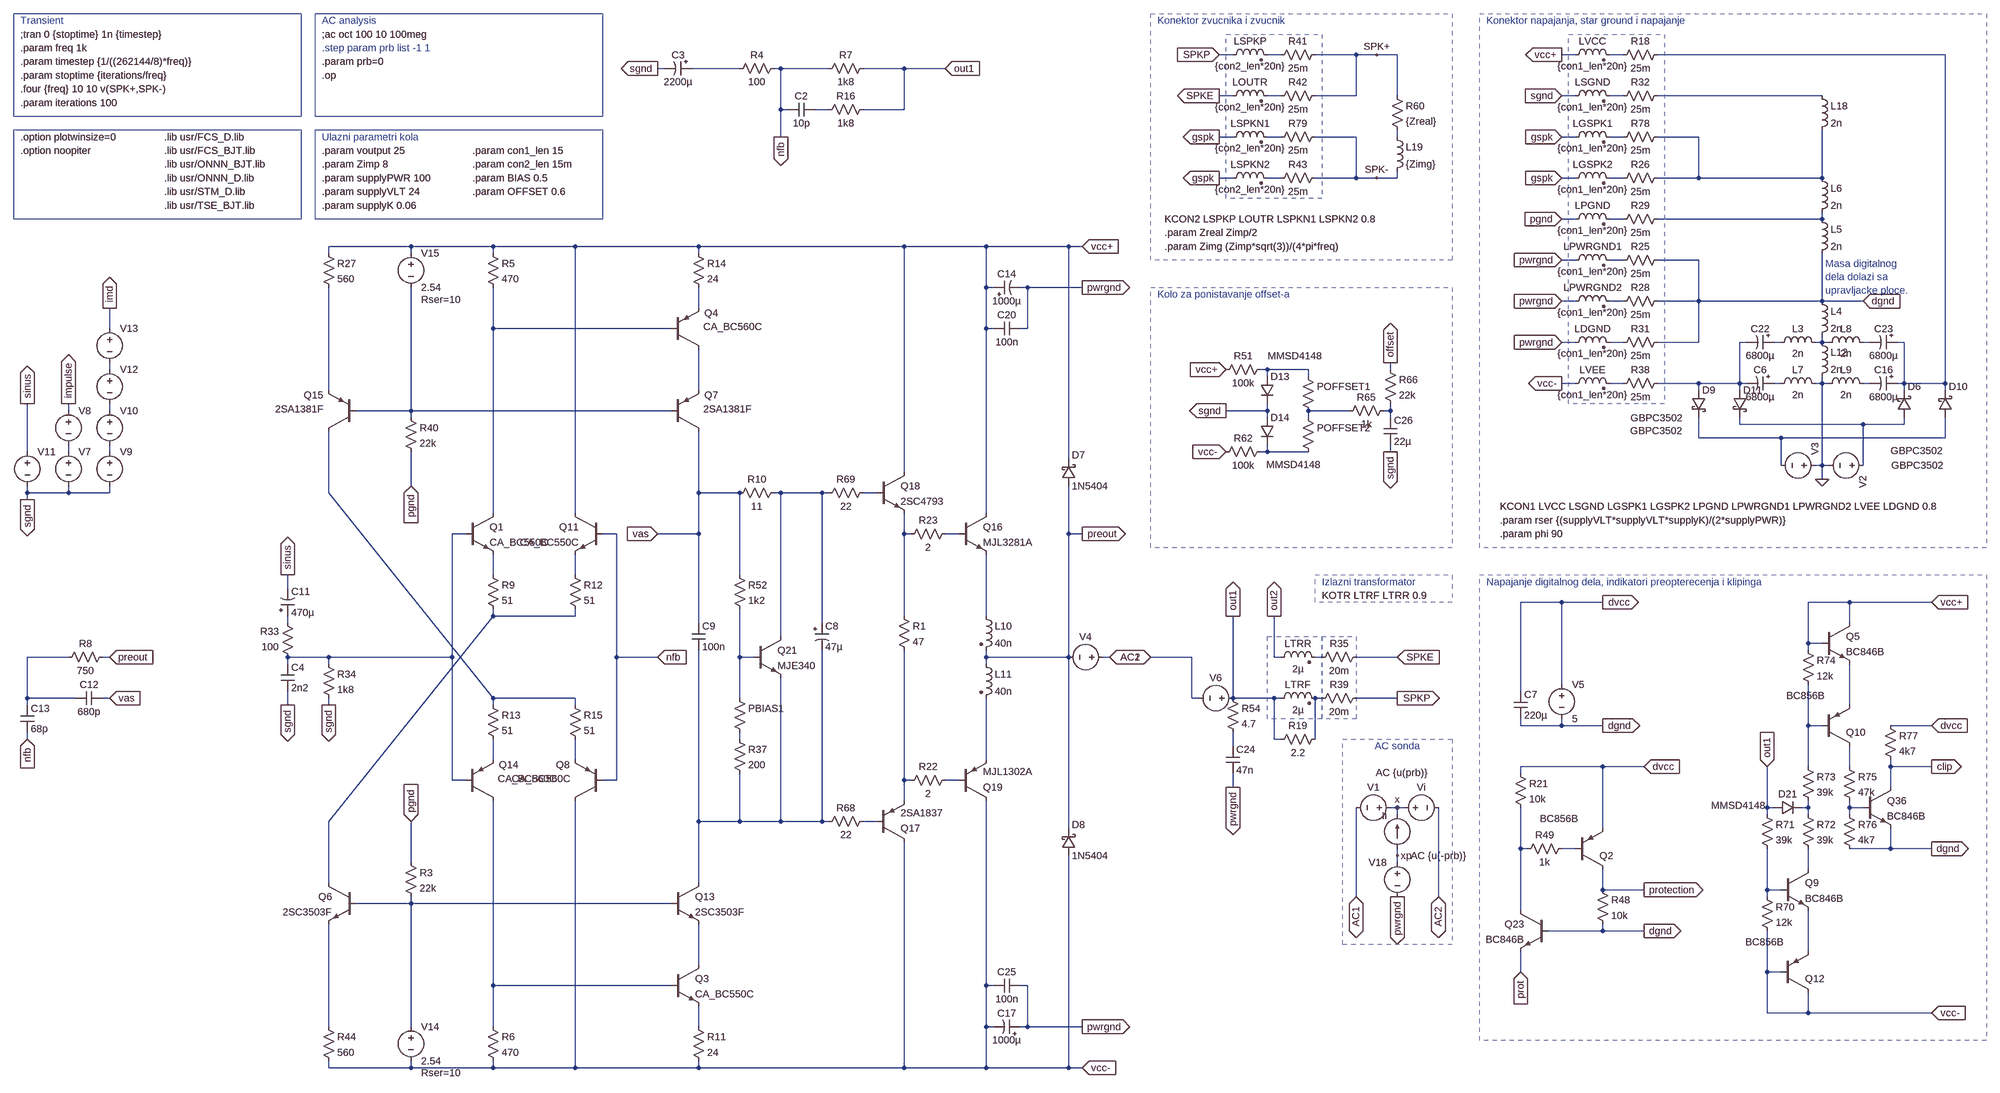
[diagram p0: schematic AMP_Impulse2.asc]
AMP_Impulse2.asc, the LTspice schematic file:
Version 4
SHEET 1 6124 2336
WIRE 2080 -1536 2048 -1536
WIRE 2192 -1536 2160 -1536
WIRE 2368 -1536 2272 -1536
WIRE 2416 -1536 2368 -1536
WIRE 2464 -1536 2416 -1536
WIRE 2880 -1536 2848 -1536
WIRE 2992 -1536 2960 -1536
WIRE 3744 -1536 3072 -1536
WIRE 752 -1504 736 -1504
WIRE 928 -1504 816 -1504
WIRE 1024 -1504 1008 -1504
WIRE 1136 -1504 1024 -1504
WIRE 1312 -1504 1216 -1504
WIRE 1408 -1504 1312 -1504
WIRE 2080 -1440 2048 -1440
WIRE 2192 -1440 2160 -1440
WIRE 2368 -1440 2368 -1536
WIRE 2368 -1440 2272 -1440
WIRE 2464 -1440 2464 -1536
WIRE 2880 -1440 2848 -1440
WIRE 2992 -1440 2960 -1440
WIRE 3456 -1440 3072 -1440
WIRE 1024 -1408 1024 -1504
WIRE 1040 -1408 1024 -1408
WIRE 1136 -1408 1104 -1408
WIRE 1312 -1408 1312 -1504
WIRE 1312 -1408 1216 -1408
WIRE 1024 -1344 1024 -1408
WIRE 2080 -1344 2048 -1344
WIRE 2192 -1344 2160 -1344
WIRE 2368 -1344 2272 -1344
WIRE 2464 -1344 2464 -1360
WIRE 2880 -1344 2848 -1344
WIRE 2992 -1344 2960 -1344
WIRE 3168 -1344 3072 -1344
WIRE 2080 -1248 2048 -1248
WIRE 2192 -1248 2160 -1248
WIRE 2368 -1248 2368 -1344
WIRE 2368 -1248 2272 -1248
WIRE 2416 -1248 2368 -1248
WIRE 2464 -1248 2464 -1264
WIRE 2464 -1248 2416 -1248
WIRE 2880 -1248 2848 -1248
WIRE 2992 -1248 2960 -1248
WIRE 3168 -1248 3168 -1344
WIRE 3168 -1248 3072 -1248
WIRE 3456 -1248 3456 -1360
WIRE 3456 -1248 3168 -1248
WIRE 2880 -1152 2848 -1152
WIRE 2992 -1152 2960 -1152
WIRE 3456 -1152 3456 -1168
WIRE 3456 -1152 3072 -1152
WIRE 160 -1088 -32 -1088
WIRE 352 -1088 160 -1088
WIRE 544 -1088 352 -1088
WIRE 832 -1088 544 -1088
WIRE 1312 -1088 832 -1088
WIRE 1408 -1088 1312 -1088
WIRE 1504 -1088 1408 -1088
WIRE 1696 -1088 1504 -1088
WIRE 1728 -1088 1696 -1088
WIRE -32 -1072 -32 -1088
WIRE 160 -1072 160 -1088
WIRE 352 -1072 352 -1088
WIRE 832 -1072 832 -1088
WIRE 2880 -1056 2848 -1056
WIRE 2992 -1056 2960 -1056
WIRE 3168 -1056 3072 -1056
WIRE 1504 -992 1504 -1088
WIRE 1520 -992 1504 -992
WIRE 1600 -992 1584 -992
WIRE 1728 -992 1600 -992
WIRE 2880 -960 2848 -960
WIRE 2992 -960 2960 -960
WIRE 3168 -960 3168 -1056
WIRE 3168 -960 3072 -960
WIRE 3456 -960 3456 -1072
WIRE 3456 -960 3168 -960
WIRE 3552 -960 3456 -960
WIRE 832 -944 832 -992
WIRE -544 -896 -544 -944
WIRE 352 -896 352 -992
WIRE 768 -896 352 -896
WIRE 1504 -896 1504 -992
WIRE 1520 -896 1504 -896
WIRE 1600 -896 1600 -992
WIRE 1600 -896 1584 -896
WIRE 2880 -864 2848 -864
WIRE 2992 -864 2960 -864
WIRE 3168 -864 3168 -960
WIRE 3168 -864 3072 -864
WIRE 3280 -864 3264 -864
WIRE 3360 -864 3344 -864
WIRE 3456 -864 3456 -880
WIRE 3456 -864 3440 -864
WIRE 3472 -864 3456 -864
WIRE 3568 -864 3552 -864
WIRE 3648 -864 3632 -864
WIRE -544 -800 -544 -816
WIRE 2160 -800 2144 -800
WIRE 2256 -800 2160 -800
WIRE 2448 -800 2448 -816
WIRE 2160 -784 2160 -800
WIRE 2256 -784 2256 -800
WIRE 2880 -768 2848 -768
WIRE 2992 -768 2960 -768
WIRE 3168 -768 3072 -768
WIRE 3264 -768 3264 -864
WIRE 3264 -768 3168 -768
WIRE 3280 -768 3264 -768
WIRE 3360 -768 3344 -768
WIRE 3456 -768 3456 -784
WIRE 3456 -768 3440 -768
WIRE 3472 -768 3456 -768
WIRE 3568 -768 3552 -768
WIRE 3648 -768 3648 -864
WIRE 3648 -768 3632 -768
WIRE 3744 -768 3744 -1536
WIRE 3744 -768 3648 -768
WIRE -32 -752 -32 -992
WIRE 832 -752 832 -848
WIRE 3168 -752 3168 -768
WIRE 3264 -752 3264 -768
WIRE 3648 -752 3648 -768
WIRE 3744 -752 3744 -768
WIRE -640 -704 -640 -720
WIRE -544 -704 -544 -720
WIRE 160 -704 160 -992
WIRE 160 -704 32 -704
WIRE 768 -704 160 -704
WIRE 1312 -704 1312 -1088
WIRE 1504 -704 1504 -896
WIRE 2160 -704 2160 -720
WIRE 2160 -704 2064 -704
WIRE 2352 -704 2256 -704
WIRE 2448 -704 2448 -720
WIRE 2448 -704 2432 -704
WIRE 160 -688 160 -704
WIRE 2160 -688 2160 -704
WIRE 2256 -688 2256 -704
WIRE 2448 -688 2448 -704
WIRE 3264 -672 3264 -688
WIRE 3552 -672 3264 -672
WIRE 3648 -672 3648 -688
WIRE 3648 -672 3552 -672
WIRE 3168 -640 3168 -688
WIRE 3360 -640 3168 -640
WIRE 3744 -640 3744 -688
WIRE 3744 -640 3360 -640
WIRE -736 -608 -736 -720
WIRE -640 -608 -640 -624
WIRE -544 -608 -544 -624
WIRE 2160 -608 2160 -624
WIRE 2160 -608 2144 -608
WIRE 2256 -608 2160 -608
WIRE 2448 -608 2448 -624
WIRE 1696 -592 1696 -1088
WIRE 3360 -576 3360 -640
WIRE 3456 -576 3456 -768
WIRE 3456 -576 3440 -576
WIRE 3472 -576 3456 -576
WIRE 3552 -576 3552 -672
WIRE 1312 -560 1312 -704
WIRE 3456 -544 3456 -576
WIRE 160 -528 160 -608
WIRE -736 -512 -736 -528
WIRE -640 -512 -640 -528
WIRE -640 -512 -736 -512
WIRE -544 -512 -544 -528
WIRE -544 -512 -640 -512
WIRE -32 -512 -32 -656
WIRE 832 -512 832 -656
WIRE 928 -512 832 -512
WIRE 1024 -512 1008 -512
WIRE 1120 -512 1024 -512
WIRE 1136 -512 1120 -512
WIRE 1248 -512 1216 -512
WIRE -736 -496 -736 -512
WIRE 352 -464 352 -896
WIRE 544 -464 544 -1088
WIRE 1504 -464 1504 -704
WIRE 288 -416 256 -416
WIRE 640 -416 608 -416
WIRE 832 -416 832 -512
WIRE 832 -416 736 -416
WIRE 1312 -416 1312 -464
WIRE 1328 -416 1312 -416
WIRE 1440 -416 1408 -416
WIRE 1696 -416 1696 -528
WIRE 1728 -416 1696 -416
WIRE 352 -320 352 -368
WIRE 544 -320 544 -368
WIRE 928 -320 928 -512
WIRE -128 -288 -128 -320
WIRE 2800 -256 2752 -256
WIRE 2848 -256 2800 -256
WIRE 2944 -256 2848 -256
WIRE 3520 -256 3424 -256
WIRE 3712 -256 3520 -256
WIRE 352 -224 352 -240
WIRE 544 -224 544 -240
WIRE 544 -224 352 -224
WIRE 1312 -224 1312 -416
WIRE 1504 -224 1504 -368
WIRE -128 -208 -128 -224
WIRE 832 -208 832 -416
WIRE 1120 -208 1120 -512
WIRE 3520 -208 3520 -256
WIRE 1024 -176 1024 -512
WIRE 3424 -160 3424 -256
WIRE 3456 -160 3424 -160
WIRE 3424 -144 3424 -160
WIRE -640 -128 -736 -128
WIRE -544 -128 -560 -128
WIRE -32 -128 -128 -128
WIRE 256 -128 256 -416
WIRE 256 -128 -32 -128
WIRE 640 -128 640 -416
WIRE 736 -128 640 -128
WIRE 928 -128 928 -240
WIRE 960 -128 928 -128
WIRE 1504 -128 1504 -144
WIRE 1600 -128 1504 -128
WIRE 1696 -128 1696 -416
WIRE 1696 -128 1600 -128
WIRE 1792 -128 1776 -128
WIRE 1984 -128 1888 -128
WIRE 2176 -128 2176 -224
WIRE 2192 -128 2176 -128
WIRE 2288 -128 2272 -128
WIRE 2464 -128 2368 -128
WIRE -128 -112 -128 -128
WIRE -32 -112 -32 -128
WIRE 1504 -112 1504 -128
WIRE 2848 -64 2848 -256
WIRE 2752 -48 2752 -256
WIRE -736 -32 -736 -128
WIRE -624 -32 -736 -32
WIRE -544 -32 -560 -32
WIRE 352 -32 -32 -512
WIRE 544 -32 352 -32
WIRE 928 -32 928 -128
WIRE 1984 -32 1984 -128
WIRE 2000 -32 1984 -32
WIRE 2080 -32 2080 -224
WIRE 2176 -32 2080 -32
WIRE 2192 -32 2176 -32
WIRE 2288 -32 2272 -32
WIRE 2464 -32 2368 -32
WIRE -736 -16 -736 -32
WIRE -128 -16 -128 -48
WIRE -32 -16 -32 -32
WIRE 352 -16 352 -32
WIRE 544 -16 544 -32
WIRE 3520 -16 3520 -112
WIRE 2752 32 2752 16
WIRE 2848 32 2848 16
WIRE 2848 32 2752 32
WIRE 2944 32 2848 32
WIRE 3424 32 3424 -64
WIRE 3456 32 3424 32
WIRE 3712 32 3616 32
WIRE -736 64 -736 48
WIRE 928 64 928 48
WIRE 2176 64 2176 -32
WIRE 2192 64 2176 64
WIRE 2272 64 2272 -32
WIRE 2080 80 2080 48
WIRE 352 112 352 64
WIRE 544 112 544 64
WIRE 1504 112 1504 -32
WIRE 2944 128 2752 128
WIRE 3040 128 2944 128
WIRE 3424 128 3424 32
WIRE 3520 128 3520 80
WIRE 3616 128 3616 112
WIRE 3712 128 3616 128
WIRE 2752 144 2752 128
WIRE 256 160 256 -128
WIRE 288 160 256 160
WIRE 640 160 640 -128
WIRE 640 160 608 160
WIRE 1312 160 1312 -144
WIRE 1328 160 1312 160
WIRE 1440 160 1408 160
WIRE 2080 176 2080 144
WIRE 3616 176 3616 128
WIRE 1312 208 1312 160
WIRE 2464 224 2448 224
WIRE 2480 224 2464 224
WIRE 3328 224 3328 128
WIRE 3344 224 3328 224
WIRE 3424 224 3424 208
WIRE 3424 224 3408 224
WIRE 3520 224 3520 208
WIRE 3552 224 3520 224
WIRE 2464 240 2464 224
WIRE 3328 240 3328 224
WIRE 3424 240 3424 224
WIRE 3520 240 3520 224
WIRE -32 256 352 -224
WIRE 832 256 832 -144
WIRE 928 256 928 144
WIRE 928 256 832 256
WIRE 1024 256 1024 -80
WIRE 1024 256 928 256
WIRE 1120 256 1120 -144
WIRE 1120 256 1024 256
WIRE 1136 256 1120 256
WIRE 1248 256 1216 256
WIRE 1696 272 1696 -128
WIRE 2944 272 2944 128
WIRE 2752 320 2752 224
WIRE 2768 320 2752 320
WIRE 2880 320 2848 320
WIRE 3616 320 3616 272
WIRE 3616 320 3520 320
WIRE 3712 320 3616 320
WIRE 2464 336 2464 320
WIRE 160 352 160 256
WIRE 2464 352 2464 336
WIRE 3424 368 3424 320
WIRE -32 400 -32 256
WIRE 832 400 832 256
WIRE 2944 416 2944 368
WIRE 3040 416 2944 416
WIRE 3328 416 3328 320
WIRE 3360 416 3328 416
WIRE 2368 432 2368 224
WIRE 2560 432 2560 224
WIRE 3328 432 3328 416
WIRE 160 448 160 432
WIRE 160 448 32 448
WIRE 768 448 160 448
WIRE 2752 464 2752 320
WIRE 2944 512 2944 496
WIRE 2944 512 2816 512
WIRE 3040 512 2944 512
WIRE 3424 560 3424 464
WIRE 832 592 832 496
WIRE 2752 608 2752 560
WIRE 3328 608 3328 512
WIRE 3360 608 3328 608
WIRE 352 640 352 208
WIRE 768 640 352 640
WIRE 1504 640 1504 208
WIRE 1520 640 1504 640
WIRE 1600 640 1584 640
WIRE 3328 704 3328 608
WIRE 3424 704 3424 656
WIRE 3424 704 3328 704
WIRE 3712 704 3424 704
WIRE -32 736 -32 496
WIRE 160 736 160 448
WIRE 352 736 352 640
WIRE 832 736 832 688
WIRE 1504 736 1504 640
WIRE 1520 736 1504 736
WIRE 1600 736 1600 640
WIRE 1600 736 1584 736
WIRE 1728 736 1600 736
WIRE -32 832 -32 816
WIRE 160 832 160 816
WIRE 160 832 -32 832
WIRE 352 832 352 816
WIRE 352 832 160 832
WIRE 544 832 544 208
WIRE 544 832 352 832
WIRE 832 832 832 816
WIRE 832 832 544 832
WIRE 1312 832 1312 304
WIRE 1312 832 832 832
WIRE 1408 832 1312 832
WIRE 1504 832 1504 736
WIRE 1504 832 1408 832
WIRE 1696 832 1696 336
WIRE 1696 832 1504 832
WIRE 1728 832 1696 832
FLAG 1728 -1088 vcc+
IOPIN 1728 -1088 In
FLAG 2464 224 x
FLAG 1728 832 vcc-
IOPIN 1728 832 In
FLAG 1408 -1504 out1
IOPIN 1408 -1504 In
FLAG 2464 336 xp
FLAG 2080 176 pwrgnd
IOPIN 2080 176 Out
FLAG -128 -16 sgnd
IOPIN -128 -16 Out
FLAG -32 -16 sgnd
IOPIN -32 -16 Out
FLAG 1728 -992 pwrgnd
IOPIN 1728 -992 Out
FLAG 2752 608 prot
IOPIN 2752 608 In
FLAG 3040 512 dgnd
IOPIN 3040 512 Out
FLAG 3040 128 dvcc
IOPIN 3040 128 In
FLAG 3040 416 protection
IOPIN 3040 416 Out
FLAG 2176 -224 out2
IOPIN 2176 -224 Out
FLAG 3712 128 clip
IOPIN 3712 128 Out
FLAG 3712 320 dgnd
IOPIN 3712 320 Out
FLAG 3712 32 dvcc
IOPIN 3712 32 In
FLAG -736 -496 sgnd
IOPIN -736 -496 Out
FLAG -736 -720 sinus
IOPIN -736 -720 Out
FLAG 1728 736 pwrgnd
IOPIN 1728 736 Out
FLAG 2848 -1536 vcc+
IOPIN 2848 -1536 Out
FLAG 2848 -768 vcc-
IOPIN 2848 -768 Out
FLAG 2848 -1248 gspk
IOPIN 2848 -1248 In
FLAG 2848 -960 pwrgnd
IOPIN 2848 -960 In
FLAG 2848 -1152 pgnd
IOPIN 2848 -1152 In
FLAG 2848 -1440 sgnd
IOPIN 2848 -1440 In
FLAG 2464 -32 SPKP
IOPIN 2464 -32 Out
FLAG 2048 -1248 gspk
IOPIN 2048 -1248 Out
FLAG 2048 -1536 SPKP
IOPIN 2048 -1536 In
FLAG 2048 -1440 SPKE
IOPIN 2048 -1440 Out
FLAG 3328 128 out1
IOPIN 3328 128 In
FLAG 3552 -960 dgnd
IOPIN 3552 -960 In
FLAG 3712 704 vcc-
IOPIN 3712 704 In
FLAG 3712 -256 vcc+
IOPIN 3712 -256 In
FLAG 2944 -256 dvcc
IOPIN 2944 -256 Out
FLAG 2944 32 dgnd
IOPIN 2944 32 Out
FLAG 2848 -1056 pwrgnd
IOPIN 2848 -1056 In
FLAG 2848 -864 pwrgnd
IOPIN 2848 -864 In
FLAG 3456 -544 0
FLAG 2064 -800 vcc+
IOPIN 2064 -800 In
FLAG 2064 -608 vcc-
IOPIN 2064 -608 In
FLAG 2064 -704 sgnd
IOPIN 2064 -704 Out
FLAG 2448 -608 sgnd
IOPIN 2448 -608 Out
FLAG 2448 -816 offset
IOPIN 2448 -816 Out
FLAG 2368 432 AC1
IOPIN 2368 432 BiDir
FLAG 2560 432 AC2
IOPIN 2560 432 BiDir
FLAG 1792 -128 AC1
IOPIN 1792 -128 BiDir
FLAG 1888 -128 AC2
IOPIN 1888 -128 BiDir
FLAG 2464 432 pwrgnd
IOPIN 2464 432 Out
FLAG 2416 -1536 SPK+
FLAG 2416 -1248 SPK-
FLAG 2464 -128 SPKE
IOPIN 2464 -128 In
FLAG 2848 -1344 gspk
IOPIN 2848 -1344 In
FLAG 2048 -1344 gspk
IOPIN 2048 -1344 Out
FLAG 1728 -416 preout
IOPIN 1728 -416 Out
FLAG 160 256 pgnd
IOPIN 160 256 In
FLAG -544 -944 imd
IOPIN -544 -944 Out
FLAG 736 -1504 sgnd
IOPIN 736 -1504 Out
FLAG 2080 -224 out1
IOPIN 2080 -224 Out
FLAG -544 -128 preout
IOPIN -544 -128 In
FLAG -640 -720 impulse
IOPIN -640 -720 Out
FLAG 1024 -1344 nfb
IOPIN 1024 -1344 Out
FLAG 736 -128 nfb
IOPIN 736 -128 In
FLAG -128 -320 sinus
IOPIN -128 -320 Out
FLAG 736 -416 vas
IOPIN 736 -416 In
FLAG -544 -32 vas
IOPIN -544 -32 In
FLAG -736 64 nfb
IOPIN -736 64 In
FLAG 160 -528 pgnd
IOPIN 160 -528 In
DATAFLAG 2800 -256 ""
DATAFLAG 1600 -128 ""
DATAFLAG 1504 -704 "ic(q16)"
DATAFLAG 1408 -1088 ""
DATAFLAG 1408 832 ""
DATAFLAG 1312 -704 "Ic(Q18)"
SYMBOL voltage 3568 -576 R90
WINDOW 123 0 0 Left 2
WINDOW 3 -94 177 Invisible 2
SYMATTR Value SINE(0 {supplyVLT*sqrt(2)} 50 0 0 {phi})
SYMATTR SpiceLine Rser={rser}
SYMATTR InstName V2
SYMBOL current 2464 320 R180
WINDOW 0 24 77 Left 2
WINDOW 3 24 0 Invisible 2
WINDOW 123 -71 178 Left 2
WINDOW 39 0 0 Left 2
SYMATTR InstName Ii
SYMATTR Value 0
SYMATTR Value2 AC {u(prb)}
SYMBOL voltage 2464 224 R270
WINDOW 0 32 56 VTop 2
WINDOW 3 -32 56 Invisible 2
WINDOW 123 -97 96 VBottom 2
WINDOW 39 -32 56 VBottom 2
SYMATTR InstName Vi
SYMATTR Value 0
SYMATTR Value2 AC {u(-prb)}
SYMBOL res -112 -112 R180
WINDOW 0 36 76 Left 2
WINDOW 3 36 40 Left 2
SYMATTR InstName R33
SYMATTR Value 100
SYMBOL res -48 -128 R0
SYMATTR InstName R34
SYMATTR Value 1k8
SYMBOL schottky 1680 -528 M180
WINDOW 0 24 72 Left 2
WINDOW 3 24 0 Left 2
SYMATTR InstName D7
SYMATTR Value 1N5404
SYMATTR Description Diode
SYMATTR Type diode
SYMBOL schottky 1680 336 M180
WINDOW 0 24 72 Left 2
WINDOW 3 24 0 Left 2
SYMATTR InstName D8
SYMATTR Value 1N5404
SYMATTR Description Diode
SYMATTR Type diode
SYMBOL ind2 2176 -16 R270
WINDOW 0 32 56 VTop 2
WINDOW 3 4 56 VBottom 2
SYMATTR InstName LTRF
SYMATTR Value 2µ
SYMATTR SpiceLine Rser=10m Rpar=3meg Cpar=1p
SYMATTR Type ind
SYMBOL res 2176 80 R270
WINDOW 0 32 56 VTop 2
WINDOW 3 0 56 VBottom 2
SYMATTR InstName R19
SYMATTR Value 2.2
SYMBOL voltage 2464 224 R90
WINDOW 0 -32 56 VBottom 2
WINDOW 3 32 56 Invisible 2
WINDOW 123 0 0 Left 2
WINDOW 39 0 0 Left 2
SYMATTR InstName V1
SYMATTR Value 0
SYMBOL schottky 3632 -688 M180
WINDOW 0 24 72 Left 2
WINDOW 3 -14 -112 Left 2
SYMATTR InstName D6
SYMATTR Value GBPC3502
SYMATTR Description Diode
SYMATTR Type diode
SYMBOL schottky 3152 -752 R0
WINDOW 3 -144 95 Left 2
SYMATTR Value GBPC3502
SYMATTR InstName D9
SYMATTR Description Diode
SYMATTR Type diode
SYMBOL voltage 3456 -576 M270
WINDOW 123 0 0 Left 2
WINDOW 3 -96 -62 Invisible 2
SYMATTR Value SINE(0 {supplyVLT*sqrt(2)} 50 0 0 {phi})
SYMATTR SpiceLine Rser={rser}
SYMATTR InstName V3
SYMBOL res 2064 -48 R0
SYMATTR InstName R54
SYMATTR Value 4.7
SYMBOL res 2448 -1456 R0
SYMATTR InstName R60
SYMATTR Value {Zreal}
SYMBOL ind 2448 -1360 R0
SYMATTR InstName L19
SYMATTR Value {Zimg}
SYMATTR SpiceLine Cpar=10p
SYMBOL voltage 2464 336 M0
WINDOW 123 0 0 Left 2
WINDOW 39 0 0 Left 2
WINDOW 3 24 96 Invisible 2
SYMATTR Value 0
SYMATTR InstName V18
SYMBOL npn 1440 -464 R0
SYMATTR InstName Q16
SYMATTR Value MJL3281A
SYMBOL pnp 1248 304 M180
SYMATTR InstName Q17
SYMATTR Value 2SA1837
SYMBOL npn 1248 -560 R0
SYMATTR InstName Q18
SYMATTR Value 2SC4793
SYMBOL pnp 1440 208 M180
SYMATTR InstName Q19
SYMATTR Value MJL1302A
SYMBOL res 1424 144 R90
WINDOW 0 0 56 VBottom 2
WINDOW 3 32 56 VTop 2
SYMATTR InstName R22
SYMATTR Value 2
SYMBOL res 1424 -432 R90
WINDOW 0 0 56 VBottom 2
WINDOW 3 32 56 VTop 2
SYMATTR InstName R23
SYMATTR Value 2
SYMBOL cap 1520 -912 M90
WINDOW 0 0 32 VBottom 2
WINDOW 3 32 32 VTop 2
SYMATTR InstName C20
SYMATTR Value 100n
SYMATTR SpiceLine Rser=700m Lser=7n Rpar=4.4meg Cpar=1p
SYMBOL ind2 1488 -240 R0
SYMATTR InstName L10
SYMATTR Value 40n
SYMATTR SpiceLine Rser=220m Cpar=3p
SYMATTR Type ind
SYMBOL ind2 1488 -128 R0
SYMATTR InstName L11
SYMATTR Value 40n
SYMATTR SpiceLine Rser=220m Cpar=3p
SYMATTR Type ind
SYMBOL cap 2064 80 R0
SYMATTR InstName C24
SYMATTR Value 47n
SYMATTR SpiceLine Rser=700m Lser=7n Rpar=4.4meg Cpar=1p
SYMBOL cap 1584 624 R90
WINDOW 0 0 32 VBottom 2
WINDOW 3 32 32 VTop 2
SYMATTR InstName C25
SYMATTR Value 100n
SYMATTR SpiceLine Rser=700m Lser=7n Rpar=4.4meg Cpar=1p
SYMBOL polcap 3344 -784 R90
WINDOW 0 0 32 VBottom 2
WINDOW 3 32 32 VTop 2
SYMATTR InstName C6
SYMATTR Value 6800µ
SYMATTR SpiceLine V=50 Irms=2.5 Rser=0.08 Lser=20n Rpar=40k Cpar=3p mfg="Nichicon" pn="UVZ1H682MRD" type="Al electrolytic"
SYMATTR Description Capacitor
SYMATTR Type cap
SYMBOL res 2736 128 R0
SYMATTR InstName R21
SYMATTR Value 10k
SYMBOL npn 2816 464 M0
SYMATTR InstName Q23
SYMATTR Value BC846B
SYMBOL pnp 2880 368 M180
WINDOW 3 -83 118 Left 2
SYMATTR Value BC856B
SYMATTR InstName Q2
SYMBOL res 2928 400 R0
SYMATTR InstName R48
SYMATTR Value 10k
SYMBOL res 2864 304 R90
WINDOW 0 0 56 VBottom 2
WINDOW 3 32 56 VTop 2
SYMATTR InstName R49
SYMATTR Value 1k
SYMBOL res 912 -48 R0
WINDOW 3 36 76 Invisible 2
SYMATTR Value {1+(500*BIAS)}
SYMATTR InstName PBIAS1
SYMBOL res 912 -336 R0
SYMATTR InstName R52
SYMATTR Value 1k2
SYMBOL schottky 3728 -688 M180
WINDOW 0 24 72 Left 2
WINDOW 3 -112 -78 Left 2
SYMATTR InstName D10
SYMATTR Value GBPC3502
SYMATTR Description Diode
SYMATTR Type diode
SYMBOL schottky 3248 -752 R0
WINDOW 3 -239 65 Left 2
SYMATTR Value GBPC3502
SYMATTR InstName D11
SYMATTR Description Diode
SYMATTR Type diode
SYMBOL ind2 2864 -1520 R270
WINDOW 0 32 56 VTop 2
WINDOW 3 5 56 VBottom 2
SYMATTR InstName LVCC
SYMATTR Value {con1_len*20n}
SYMATTR SpiceLine Rser={con1_len*.5m}
SYMATTR Type ind
SYMBOL ind2 2864 -752 R270
WINDOW 0 32 56 VTop 2
WINDOW 3 5 56 VBottom 2
SYMATTR InstName LVEE
SYMATTR Value {con1_len*20n}
SYMATTR SpiceLine Rser={con1_len*.5m}
SYMATTR Type ind
SYMBOL ind2 2176 -112 R270
WINDOW 0 32 56 VTop 2
WINDOW 3 4 56 VBottom 2
SYMATTR InstName LTRR
SYMATTR Value 2µ
SYMATTR SpiceLine Rser=80m Rpar=3meg Cpar=1p
SYMATTR Type ind
SYMBOL res 3312 416 R0
SYMATTR InstName R70
SYMATTR Value 12k
SYMBOL res 3312 224 R0
SYMATTR InstName R71
SYMATTR Value 39k
SYMBOL res 3408 224 R0
SYMATTR InstName R72
SYMATTR Value 39k
SYMBOL diode 3344 240 R270
WINDOW 0 32 32 VTop 2
WINDOW 3 37 -83 VBottom 2
SYMATTR InstName D21
SYMATTR Value MMSD4148
SYMBOL res 3408 112 R0
SYMATTR InstName R73
SYMATTR Value 39k
SYMBOL res 3408 -160 R0
SYMATTR InstName R74
SYMATTR Value 12k
SYMBOL res 3504 112 R0
SYMATTR InstName R75
SYMATTR Value 47k
SYMBOL npn 3552 176 R0
SYMATTR InstName Q36
SYMATTR Value BC846B
SYMBOL res 3504 224 R0
SYMATTR InstName R76
SYMATTR Value 4k7
SYMBOL res 3600 16 R0
SYMATTR InstName R77
SYMATTR Value 4k7
SYMBOL cap -144 -48 M180
WINDOW 0 24 56 Left 2
WINDOW 3 24 8 Left 2
SYMATTR InstName C4
SYMATTR Value 2n2
SYMBOL voltage -736 -624 R0
WINDOW 123 24 44 Left 2
WINDOW 39 0 0 Left 2
WINDOW 3 24 96 Invisible 2
SYMATTR Value SINE(0 {voutput/18} {freq})
SYMATTR InstName V11
SYMBOL res 1296 -240 R0
SYMATTR InstName R1
SYMATTR Value 47
SYMBOL npn 960 -176 R0
SYMATTR InstName Q21
SYMATTR Value MJE340
SYMBOL ind2 2864 -1232 R270
WINDOW 0 32 56 VTop 2
WINDOW 3 5 56 VBottom 2
SYMATTR InstName LGSPK2
SYMATTR Value {con1_len*20n}
SYMATTR SpiceLine Rser={con1_len*.5m}
SYMATTR Type ind
SYMBOL ind2 2864 -944 R270
WINDOW 0 32 56 VTop 2
WINDOW 3 5 56 VBottom 2
SYMATTR InstName LPWRGND2
SYMATTR Value {con1_len*20n}
SYMATTR SpiceLine Rser={con1_len*.5m}
SYMATTR Type ind
SYMBOL ind2 2864 -1136 R270
WINDOW 0 32 56 VTop 2
WINDOW 3 5 56 VBottom 2
SYMATTR InstName LPGND
SYMATTR Value {con1_len*20n}
SYMATTR SpiceLine Rser={con1_len*.5m}
SYMATTR Type ind
SYMBOL ind2 2864 -1424 R270
WINDOW 0 32 56 VTop 2
WINDOW 3 5 56 VBottom 2
SYMATTR InstName LSGND
SYMATTR Value {con1_len*20n}
SYMATTR SpiceLine Rser={con1_len*.5m}
SYMATTR Type ind
SYMBOL res 3088 -1552 R90
WINDOW 0 0 56 VBottom 2
WINDOW 3 32 56 VTop 2
SYMATTR InstName R18
SYMATTR Value 25m
SYMBOL res 3088 -1264 R90
WINDOW 0 0 56 VBottom 2
WINDOW 3 32 56 VTop 2
SYMATTR InstName R26
SYMATTR Value 25m
SYMBOL res 3088 -976 R90
WINDOW 0 0 56 VBottom 2
WINDOW 3 32 56 VTop 2
SYMATTR InstName R28
SYMATTR Value 25m
SYMBOL res 3088 -1168 R90
WINDOW 0 0 56 VBottom 2
WINDOW 3 32 56 VTop 2
SYMATTR InstName R29
SYMATTR Value 25m
SYMBOL res 3088 -1456 R90
WINDOW 0 0 56 VBottom 2
WINDOW 3 32 56 VTop 2
SYMATTR InstName R32
SYMATTR Value 25m
SYMBOL res 3088 -784 R90
WINDOW 0 0 56 VBottom 2
WINDOW 3 32 56 VTop 2
SYMATTR InstName R38
SYMATTR Value 25m
SYMBOL ind 3440 -976 R0
SYMATTR InstName L4
SYMATTR Value 2n
SYMATTR SpiceLine Rser=1m
SYMBOL ind 3440 -1168 R0
SYMATTR InstName L5
SYMATTR Value 2n
SYMATTR SpiceLine Rser=1m
SYMBOL ind 3440 -1264 R0
SYMATTR InstName L6
SYMATTR Value 2n
SYMATTR SpiceLine Rser=1m
SYMBOL ind 3440 -1456 R0
SYMATTR InstName L18
SYMATTR Value 2n
SYMATTR SpiceLine Rser=1m
SYMBOL ind2 2064 -1520 R270
WINDOW 0 32 56 VTop 2
WINDOW 3 5 56 VBottom 2
SYMATTR InstName LSPKP
SYMATTR Value {con2_len*20n}
SYMATTR SpiceLine Rser={con2_len*.5m}
SYMATTR Type ind
SYMBOL ind2 2064 -1424 R270
WINDOW 0 32 56 VTop 2
WINDOW 3 5 56 VBottom 2
SYMATTR InstName LOUTR
SYMATTR Value {con2_len*20n}
SYMATTR SpiceLine Rser={con2_len*.5m}
SYMATTR Type ind
SYMBOL ind2 2064 -1232 R270
WINDOW 0 32 56 VTop 2
WINDOW 3 5 56 VBottom 2
SYMATTR InstName LSPKN2
SYMATTR Value {con2_len*20n}
SYMATTR SpiceLine Rser={con2_len*.5m}
SYMATTR Type ind
SYMBOL res 2384 -144 R90
WINDOW 0 0 56 VBottom 2
WINDOW 3 32 56 VTop 2
SYMATTR InstName R35
SYMATTR Value 20m
SYMBOL res 2384 -48 R90
WINDOW 0 0 56 VBottom 2
WINDOW 3 32 56 VTop 2
SYMATTR InstName R39
SYMATTR Value 20m
SYMBOL res 2288 -1552 R90
WINDOW 0 0 56 VBottom 2
WINDOW 3 32 56 VTop 2
SYMATTR InstName R41
SYMATTR Value 25m
SYMBOL res 2288 -1456 R90
WINDOW 0 0 56 VBottom 2
WINDOW 3 32 56 VTop 2
SYMATTR InstName R42
SYMATTR Value 25m
SYMBOL res 2288 -1264 R90
WINDOW 0 0 56 VBottom 2
WINDOW 3 32 56 VTop 2
SYMATTR InstName R43
SYMATTR Value 25m
SYMBOL ind2 2864 -848 R270
WINDOW 0 32 56 VTop 2
WINDOW 3 5 56 VBottom 2
SYMATTR InstName LDGND
SYMATTR Value {con1_len*20n}
SYMATTR SpiceLine Rser={con1_len*.5m}
SYMATTR Type ind
SYMBOL res 3088 -880 R90
WINDOW 0 0 56 VBottom 2
WINDOW 3 32 56 VTop 2
SYMATTR InstName R31
SYMATTR Value 25m
SYMBOL cap 2736 -48 R0
SYMATTR InstName C7
SYMATTR Value 220µ
SYMATTR SpiceLine Rser=100m Lser=50n Rpar=100k Cpar=3p
SYMBOL voltage 2848 -80 R0
WINDOW 123 0 0 Left 2
SYMATTR InstName V5
SYMATTR Value 5
SYMATTR SpiceLine Rser=10
SYMBOL ind2 2864 -1040 R270
WINDOW 0 32 56 VTop 2
WINDOW 3 5 56 VBottom 2
SYMATTR InstName LPWRGND1
SYMATTR Value {con1_len*20n}
SYMATTR SpiceLine Rser={con1_len*.5m}
SYMATTR Type ind
SYMBOL res 3088 -1072 R90
WINDOW 0 0 56 VBottom 2
WINDOW 3 32 56 VTop 2
SYMATTR InstName R25
SYMATTR Value 25m
SYMBOL voltage -640 -624 R0
WINDOW 3 24 96 Invisible 2
WINDOW 123 0 0 Left 2
WINDOW 39 0 0 Left 2
SYMATTR Value PULSE(0 {voutput/18} 1u 1n 1n {1/(freq*2)} {1/freq})
SYMATTR InstName V7
SYMBOL voltage -640 -720 R0
WINDOW 3 24 96 Invisible 2
WINDOW 123 0 0 Left 2
WINDOW 39 0 0 Left 2
SYMATTR Value PULSE(0 {-voutput/18} {1u+(1/(freq*2))} 1n 1n {1/(freq*2)} {1/freq})
SYMATTR InstName V8
SYMBOL polcap -144 -224 M180
WINDOW 3 24 8 Left 2
WINDOW 0 24 57 Left 2
SYMATTR Value 470µ
SYMATTR InstName C11
SYMATTR SpiceLine V=6.3 Irms=290m Rser=0.5 Lser=3n Rpar=100k Cpar=3p
SYMATTR Description Capacitor
SYMATTR Type cap
SYMBOL polcap 1520 -976 R270
WINDOW 0 32 32 VTop 2
WINDOW 3 0 32 VBottom 2
SYMATTR InstName C14
SYMATTR Value 1000µ
SYMATTR SpiceLine V=63 Irms=2.77 Rser=0.036 Lser=5n Rpar=100k Cpar=3p mfg="Nichicon" pn="UPW1J102MHD6" type="Al electrolytic"
SYMATTR Description Capacitor
SYMATTR Type cap
SYMBOL polcap 1584 752 M270
WINDOW 0 32 32 VTop 2
WINDOW 3 0 32 VBottom 2
SYMATTR InstName C17
SYMATTR Value 1000µ
SYMATTR SpiceLine V=63 Irms=2.77 Rser=0.036 Lser=5n Rpar=100k Cpar=3p mfg="Nichicon" pn="UPW1J102MHD6" type="Al electrolytic"
SYMATTR Description Capacitor
SYMATTR Type cap
SYMBOL polcap 3632 -784 R90
WINDOW 0 0 32 VBottom 2
WINDOW 3 32 32 VTop 2
SYMATTR InstName C16
SYMATTR Value 6800µ
SYMATTR SpiceLine V=50 Irms=2.5 Rser=0.08 Lser=20n Rpar=40k Cpar=3p mfg="Nichicon" pn="UVZ1H682MRD" type="Al electrolytic"
SYMATTR Description Capacitor
SYMATTR Type cap
SYMBOL polcap 3344 -880 R90
WINDOW 0 0 32 VBottom 2
WINDOW 3 32 32 VTop 2
SYMATTR InstName C22
SYMATTR Value 6800µ
SYMATTR SpiceLine V=50 Irms=2.5 Rser=0.08 Lser=20n Rpar=40k Cpar=3p mfg="Nichicon" pn="UVZ1H682MRD" type="Al electrolytic"
SYMATTR Description Capacitor
SYMATTR Type cap
SYMBOL polcap 3632 -880 R90
WINDOW 0 0 32 VBottom 2
WINDOW 3 32 32 VTop 2
SYMATTR InstName C23
SYMATTR Value 6800µ
SYMATTR SpiceLine V=50 Irms=2.5 Rser=0.08 Lser=20n Rpar=40k Cpar=3p mfg="Nichicon" pn="UVZ1H682MRD" type="Al electrolytic"
SYMATTR Description Capacitor
SYMATTR Type cap
SYMBOL ind 3344 -848 R270
WINDOW 0 32 56 VTop 2
WINDOW 3 5 56 VBottom 2
SYMATTR InstName L3
SYMATTR Value 2n
SYMATTR SpiceLine Rser=1m
SYMBOL ind 3344 -752 R270
WINDOW 0 32 56 VTop 2
WINDOW 3 5 56 VBottom 2
SYMATTR InstName L7
SYMATTR Value 2n
SYMATTR SpiceLine Rser=1m
SYMBOL ind 3456 -848 R270
WINDOW 0 32 56 VTop 2
WINDOW 3 5 56 VBottom 2
SYMATTR InstName L8
SYMATTR Value 2n
SYMATTR SpiceLine Rser=1m
SYMBOL ind 3456 -752 R270
WINDOW 0 32 56 VTop 2
WINDOW 3 5 56 VBottom 2
SYMATTR InstName L9
SYMATTR Value 2n
SYMATTR SpiceLine Rser=1m
SYMBOL ind 3440 -880 R0
SYMATTR InstName L12
SYMATTR Value 2n
SYMATTR SpiceLine Rser=1m
SYMBOL res 912 48 R0
SYMATTR InstName R37
SYMATTR Value 200
SYMBOL res 2048 -784 R270
WINDOW 0 32 56 VTop 2
WINDOW 3 0 56 VBottom 2
SYMATTR InstName R51
SYMATTR Value 100k
SYMBOL res 2160 -624 R90
WINDOW 0 0 56 VBottom 2
WINDOW 3 32 56 VTop 2
SYMATTR InstName R62
SYMATTR Value 100k
SYMBOL diode 2144 -784 R0
WINDOW 3 17 -48 Left 2
SYMATTR Value MMSD4148
SYMATTR InstName D13
SYMBOL diode 2144 -688 R0
WINDOW 3 14 110 Left 2
SYMATTR Value MMSD4148
SYMATTR InstName D14
SYMBOL res 2240 -800 R0
WINDOW 3 45 -160 Invisible 2
SYMATTR Value {1+(10k*OFFSET)}
SYMATTR InstName POFFSET1
SYMBOL res 2240 -704 R0
WINDOW 3 49 222 Invisible 2
SYMATTR Value {1+(10k*(1-OFFSET))}
SYMATTR InstName POFFSET2
SYMBOL res 2448 -720 R90
WINDOW 0 0 56 VBottom 2
WINDOW 3 32 56 VTop 2
SYMATTR InstName R65
SYMATTR Value 1k
SYMBOL cap 2432 -624 M180
WINDOW 0 24 57 Left 2
WINDOW 3 24 8 Left 2
SYMATTR InstName C26
SYMATTR Value 22µ
SYMATTR SpiceLine V=50 Irms=90m Rser=2 Lser=2n Rpar=2meg Cpar=2p mfg="Panasonic" pn="ECEA1HN220U" type="Al bipolar"
SYMBOL res 2432 -816 R0
SYMATTR InstName R66
SYMATTR Value 22k
SYMBOL voltage 1792 -128 R90
WINDOW 0 -32 56 VBottom 2
WINDOW 3 32 56 Invisible 2
WINDOW 123 0 0 Left 2
WINDOW 39 0 0 Left 2
SYMATTR InstName V4
SYMATTR Value 0
SYMBOL voltage 2096 -32 R90
WINDOW 0 -32 56 VBottom 2
WINDOW 3 32 56 Invisible 2
WINDOW 123 0 0 Left 2
WINDOW 39 0 0 Left 2
SYMATTR InstName V6
SYMATTR Value 0
SYMBOL res 1232 240 R90
WINDOW 0 0 56 VBottom 2
WINDOW 3 32 56 VTop 2
SYMATTR InstName R68
SYMATTR Value 22
SYMBOL res 1232 -528 R90
WINDOW 0 0 56 VBottom 2
WINDOW 3 32 56 VTop 2
SYMATTR InstName R69
SYMATTR Value 22
SYMBOL ind2 2864 -1328 R270
WINDOW 0 32 56 VTop 2
WINDOW 3 5 56 VBottom 2
SYMATTR InstName LGSPK1
SYMATTR Value {con1_len*20n}
SYMATTR SpiceLine Rser={con1_len*.5m}
SYMATTR Type ind
SYMBOL res 3088 -1360 R90
WINDOW 0 0 56 VBottom 2
WINDOW 3 32 56 VTop 2
SYMATTR InstName R78
SYMATTR Value 25m
SYMBOL ind2 2064 -1328 R270
WINDOW 0 32 56 VTop 2
WINDOW 3 5 56 VBottom 2
SYMATTR InstName LSPKN1
SYMATTR Value {con2_len*20n}
SYMATTR SpiceLine Rser={con2_len*.5m}
SYMATTR Type ind
SYMBOL res 2288 -1360 R90
WINDOW 0 0 56 VBottom 2
WINDOW 3 32 56 VTop 2
SYMATTR InstName R79
SYMATTR Value 25m
SYMBOL voltage -544 -624 R0
WINDOW 3 24 96 Invisible 2
WINDOW 123 0 0 Left 2
WINDOW 39 0 0 Left 2
SYMATTR Value SINE(0 {voutput/72} 19k)
SYMATTR InstName V9
SYMBOL voltage -544 -720 R0
WINDOW 3 24 96 Invisible 2
WINDOW 123 0 0 Left 2
WINDOW 39 0 0 Left 2
SYMATTR Value SINE(0 {voutput/72} 17k)
SYMATTR InstName V10
SYMBOL npn 3456 -208 R0
SYMATTR InstName Q5
SYMATTR Value BC846B
SYMBOL npn 3360 368 R0
SYMATTR InstName Q9
SYMATTR Value BC846B
SYMBOL pnp 3456 80 M180
WINDOW 3 -83 118 Left 2
SYMATTR Value BC856B
SYMATTR InstName Q10
SYMBOL pnp 3360 656 M180
WINDOW 3 -83 118 Left 2
SYMATTR Value BC856B
SYMATTR InstName Q12
SYMBOL res 1024 -528 R90
WINDOW 0 0 56 VBottom 2
WINDOW 3 32 56 VTop 2
SYMATTR InstName R10
SYMATTR Value 11
SYMBOL polcap 1104 -208 R0
SYMATTR Value 47µ
SYMATTR InstName C8
SYMATTR SpiceLine V=6.3 Irms=290m Rser=0.5 Lser=3n Rpar=100k Cpar=3p mfg="Nichicon" pn="UPW0J221MED1TD" type="Al electrolytic"
SYMATTR Description Capacitor
SYMATTR Type cap
SYMBOL res 816 -1088 R0
SYMATTR InstName R14
SYMATTR Value 24
SYMBOL pnp 288 208 M180
WINDOW 0 77 84 Left 2
WINDOW 3 75 52 Left 2
SYMATTR InstName Q14
SYMATTR Value CA_BC560C
SYMBOL res 816 720 R0
SYMATTR InstName R11
SYMATTR Value 24
SYMBOL res -48 720 R0
SYMATTR InstName R44
SYMATTR Value 560
SYMBOL pnp 32 -656 R180
WINDOW 0 77 84 Left 2
WINDOW 3 75 52 Left 2
SYMATTR InstName Q15
SYMATTR Value 2SA1381F
SYMBOL res -48 -1088 R0
SYMATTR InstName R27
SYMATTR Value 560
SYMBOL res 144 -704 R0
SYMATTR InstName R40
SYMATTR Value 22k
SYMBOL cap 816 -208 R0
SYMATTR InstName C9
SYMATTR Value 100n
SYMATTR SpiceLine Rser=30m Lser=3n Rpar=700k
SYMBOL voltage -544 -816 R0
WINDOW 3 24 96 Invisible 2
WINDOW 123 0 0 Left 2
WINDOW 39 0 0 Left 2
SYMATTR Value SINE(0 {voutput/72} 3k)
SYMATTR InstName V12
SYMBOL voltage -544 -912 R0
WINDOW 3 24 96 Invisible 2
WINDOW 123 0 0 Left 2
WINDOW 39 0 0 Left 2
SYMATTR Value SINE(0 {voutput/72} 5k)
SYMATTR InstName V13
SYMBOL npn 288 -464 R0
SYMATTR InstName Q1
SYMATTR Value CA_BC550C
SYMBOL npn 32 400 M0
SYMATTR InstName Q6
SYMATTR Value 2SC3503F
SYMBOL res 144 336 R0
SYMATTR InstName R3
SYMATTR Value 22k
SYMBOL polcap 816 -1520 R90
WINDOW 0 0 32 VBottom 2
WINDOW 3 32 32 VTop 2
SYMATTR InstName C3
SYMATTR Value 2200µ
SYMATTR SpiceLine V=10 Irms=1.25 Rser=0.08 Lser=10n Rpar=110k Cpar=3p
SYMATTR Description Capacitor
SYMATTR Type cap
SYMBOL res 1024 -1520 R90
WINDOW 0 0 56 VBottom 2
WINDOW 3 32 56 VTop 2
SYMATTR InstName R4
SYMATTR Value 100
SYMBOL res 1232 -1520 R90
WINDOW 0 0 56 VBottom 2
WINDOW 3 32 56 VTop 2
SYMATTR InstName R7
SYMATTR Value 1k8
SYMBOL cap -560 -48 R90
WINDOW 0 0 32 VBottom 2
WINDOW 3 32 32 VTop 2
SYMATTR InstName C12
SYMATTR Value 680p
SYMBOL res -544 -144 R90
WINDOW 0 0 56 VBottom 2
WINDOW 3 32 56 VTop 2
SYMATTR InstName R8
SYMATTR Value 750
SYMBOL pnp 608 208 R180
WINDOW 0 77 84 Left 2
WINDOW 3 75 52 Left 2
SYMATTR InstName Q8
SYMATTR Value CA_BC560C
SYMBOL npn 608 -464 M0
SYMATTR InstName Q11
SYMATTR Value CA_BC550C
SYMBOL res 336 -1088 R0
SYMATTR InstName R5
SYMATTR Value 470
SYMBOL res 336 720 R0
SYMATTR InstName R6
SYMATTR Value 470
SYMBOL res 336 -336 R0
SYMATTR InstName R9
SYMATTR Value 51
SYMBOL res 528 -336 R0
SYMATTR InstName R12
SYMATTR Value 51
SYMBOL res 336 -32 R0
SYMATTR InstName R13
SYMATTR Value 51
SYMBOL res 528 -32 R0
SYMATTR InstName R15
SYMATTR Value 51
SYMBOL res 1232 -1424 R90
WINDOW 0 0 56 VBottom 2
WINDOW 3 32 56 VTop 2
SYMATTR InstName R16
SYMATTR Value 1k8
SYMBOL cap 1104 -1424 R90
WINDOW 0 0 32 VBottom 2
WINDOW 3 32 32 VTop 2
SYMATTR InstName C2
SYMATTR Value 10p
SYMBOL cap -752 -16 R0
SYMATTR InstName C13
SYMATTR Value 68p
SYMBOL npn 768 400 R0
SYMATTR InstName Q13
SYMATTR Value 2SC3503F
SYMBOL npn 768 592 R0
SYMATTR InstName Q3
SYMATTR Value CA_BC550C
SYMBOL pnp 768 -656 M180
WINDOW 0 77 84 Left 2
WINDOW 3 75 52 Left 2
SYMATTR InstName Q7
SYMATTR Value 2SA1381F
SYMBOL pnp 768 -848 M180
WINDOW 0 77 84 Left 2
WINDOW 3 75 52 Left 2
SYMATTR InstName Q4
SYMATTR Value CA_BC560C
SYMBOL voltage 160 720 R0
WINDOW 123 0 0 Left 2
WINDOW 39 24 124 Left 2
SYMATTR InstName V14
SYMATTR Value 2.54
SYMATTR SpiceLine Rser=10
SYMBOL voltage 160 -1088 R0
WINDOW 123 0 0 Left 2
WINDOW 39 24 124 Left 2
SYMATTR InstName V15
SYMATTR Value 2.54
SYMATTR SpiceLine Rser=10
TEXT -48 -1488 Left 2 !.op
TEXT -752 -1344 Left 2 !.option plotwinsize=0
TEXT -752 -1312 Left 2 !.option noopiter
TEXT -752 -1616 Left 2 ;Transient
TEXT -752 -1456 Left 2 !.four {freq} 10 10 v(SPK+,SPK-)
TEXT -48 -1520 Left 2 !.param prb=0
TEXT -752 -1520 Left 2 !.param timestep {1/((262144/8)*freq)}
TEXT -752 -1552 Left 2 !.param freq 1k
TEXT -752 -1488 Left 2 !.param stoptime {iterations/freq}
TEXT -48 -1584 Left 2 !;ac oct 100 10 100meg
TEXT -48 -1552 Left 2 ;.step param prb list -1 1
TEXT -48 -1616 Left 2 ;AC analysis
TEXT -752 -1424 Left 2 !.param iterations 100
TEXT -416 -1280 Left 2 !.lib usr/ONNN_BJT.lib
TEXT -48 -1280 Left 2 !.param Zimp 8
TEXT 1920 -1120 Left 2 !.param Zreal Zimp/2
TEXT 1920 -1088 Left 2 !.param Zimg (Zimp*sqrt(3))/(4*pi*freq)
TEXT -48 -1248 Left 2 !.param supplyPWR 100
TEXT -48 -1216 Left 2 !.param supplyVLT 24
TEXT -416 -1216 Left 2 !.lib usr/STM_D.lib
TEXT -416 -1312 Left 2 !.lib usr/FCS_BJT.lib
TEXT -48 -1312 Left 2 !.param voutput 25
TEXT -48 -1184 Left 2 !.param supplyK 0.06
TEXT 2704 -448 Left 2 !.param rser {(supplyVLT*supplyVLT*supplyK)/(2*supplyPWR)}
TEXT -752 -1584 Left 2 !;tran 0 {stoptime} 1n {timestep}
TEXT 2704 -416 Left 2 !.param phi 90
TEXT 304 -1312 Left 2 !.param con1_len 15
TEXT 2704 -480 Left 2 !KCON1 LVCC LSGND LGSPK1 LGSPK2 LPGND LPWRGND1 LPWRGND2 LVEE LDGND 0.8
TEXT 304 -1280 Left 2 !.param con2_len 15m
TEXT 1920 -1152 Left 2 !KCON2 LSPKP LOUTR LSPKN1 LSPKN2 0.8
TEXT 2288 -272 Left 2 !KOTR LTRF LTRR 0.9
TEXT 1904 -1616 Left 2 ;Konektor zvucnika i zvucnik
TEXT 2672 -1616 Left 2 ;Konektor napajanja, star ground i napajanje
TEXT 2672 -304 Left 2 ;Napajanje digitalnog dela, indikatori preopterecenja i klipinga
TEXT -48 -1344 Left 2 ;Ulazni parametri kola
TEXT 2288 -304 Left 2 ;Izlazni transformator
TEXT 2464 80 Center 2 ;AC sonda
TEXT 3464 -1048 Left 2 ;Masa digitalnog \ndela dolazi sa \nupravljacke ploce.
TEXT -416 -1344 Left 2 !.lib usr/FCS_D.lib
TEXT 304 -1248 Left 2 !.param BIAS 0.5
TEXT 304 -1216 Left 2 !.param OFFSET 0.6
TEXT 1904 -976 Left 2 ;Kolo za ponistavanje offset-a
TEXT -416 -1248 Left 2 !.lib usr/ONNN_D.lib
TEXT -416 -1184 Left 2 !.lib usr/TSE_BJT.lib
RECTANGLE Normal -96 -1632 -768 -1392
RECTANGLE Normal -96 -1152 -768 -1360
RECTANGLE Normal 608 -1632 -64 -1392
RECTANGLE Normal 608 -1152 -64 -1360
RECTANGLE Normal 3840 -384 2656 -1632 2
RECTANGLE Normal 2592 -1056 1888 -1632 2
RECTANGLE Normal 3840 768 2656 -320 2
RECTANGLE Normal 2592 -256 2272 -320 2
RECTANGLE Normal 2288 16 2160 -176 2
RECTANGLE Normal 2592 544 2336 64 2
RECTANGLE Normal 3088 -720 2864 -1584 2
RECTANGLE Normal 2288 -1200 2064 -1584 2
RECTANGLE Normal 2368 16 2288 -176 2
RECTANGLE Normal 2592 -384 1888 -992 2

The netlist it stands for:
* AMP_Impulse2.asc
V2 N037 0 SINE(0 {supplyVLT*sqrt(2)} 50 0 0 {phi}) Rser={rser}
Ii xp x 0 AC {u(prb)}
Vi x AC2 0 AC {u(-prb)}
R33 N045 N052 100
R34 N045 sgnd 1k8
D7 preout vcc+ 1N5404
D8 vcc- preout 1N5404
LTRF out1 N056 2µ Rser=10m Rpar=3meg Cpar=1p
R19 out1 N056 2.2
V1 x AC1 0
D6 N037 N003 GBPC3502
D9 N022 N038 GBPC3502
V3 0 N038 SINE(0 {supplyVLT*sqrt(2)} 50 0 0 {phi}) Rser={rser}
R54 out1 N060 4.7
R60 SPK+ N010 {Zreal}
L19 N010 SPK- {Zimg} Cpar=10p
V18 xp pwrgnd 0
Q16 vcc+ N047 N051 0 MJL3281A
Q17 vcc- N070 N065 0 2SA1837
Q18 vcc+ N044 N046 0 2SC4793
Q19 vcc- N066 N063 0 MJL1302A
R22 N066 N065 2
R23 N047 N046 2
C20 vcc+ pwrgnd 100n Rser=700m Lser=7n Rpar=4.4meg Cpar=1p
L10 N051 preout 40n Rser=220m Cpar=3p
L11 preout N063 40n Rser=220m Cpar=3p
C24 N060 pwrgnd 47n Rser=700m Lser=7n Rpar=4.4meg Cpar=1p
C25 pwrgnd vcc- 100n Rser=700m Lser=7n Rpar=4.4meg Cpar=1p
C6 N029 N022 6800µ V=50 Irms=2.5 Rser=0.08 Lser=20n Rpar=40k Cpar=3p mfg="Nichicon" pn="UVZ1H682MRD" type="Al electrolytic"
R21 dvcc N071 10k
Q23 N071 dgnd prot 0 BC846B
Q2 protection N072 dvcc 0 BC856B
R48 protection dgnd 10k
R49 N072 N071 1k
R§PBIAS1 N054 N059 {1+(500*BIAS)}
R52 vas N054 1k2
D10 N038 N003 GBPC3502
D11 N022 N037 GBPC3502
LVCC vcc+ N002 {con1_len*20n} Rser={con1_len*.5m}
LVEE vcc- N028 {con1_len*20n} Rser={con1_len*.5m}
LTRR out2 N055 2µ Rser=80m Rpar=3meg Cpar=1p
R70 N074 vcc- 12k
R71 out1 N074 39k
R72 N067 N073 39k
D21 out1 N067 MMSD4148
R73 N058 N067 39k
R74 vcc+ N058 12k
R75 N064 N068 47k
Q36 clip N068 dgnd 0 BC846B
R76 N068 dgnd 4k7
R77 dvcc clip 4k7
C4 sgnd N045 2n2
V11 sinus sgnd SINE(0 {voutput/18} {freq})
R1 N046 N065 47
Q21 N043 N054 N069 0 MJE340
LGSPK2 gspk N014 {con1_len*20n} Rser={con1_len*.5m}
LPWRGND2 pwrgnd N018 {con1_len*20n} Rser={con1_len*.5m}
LPGND pgnd N015 {con1_len*20n} Rser={con1_len*.5m}
LSGND sgnd N006 {con1_len*20n} Rser={con1_len*.5m}
R18 N003 N002 25m
R26 N012 N014 25m
R28 dgnd N018 25m
R29 N016 N015 25m
R32 N007 N006 25m
R38 N022 N028 25m
L4 dgnd N024 2n Rser=1m
L5 N016 dgnd 2n Rser=1m
L6 N012 N016 2n Rser=1m
L18 N007 N012 2n Rser=1m
LSPKP SPKP N001 {con2_len*20n} Rser={con2_len*.5m}
LOUTR SPKE N005 {con2_len*20n} Rser={con2_len*.5m}
LSPKN2 gspk N013 {con2_len*20n} Rser={con2_len*.5m}
R35 SPKE N055 20m
R39 SPKP N056 20m
R41 SPK+ N001 25m
R42 SPK+ N005 25m
R43 SPK- N013 25m
LDGND pwrgnd N021 {con1_len*20n} Rser={con1_len*.5m}
R31 dgnd N021 25m
C7 dvcc dgnd 220µ Rser=100m Lser=50n Rpar=100k Cpar=3p
V5 dvcc dgnd 5 Rser=10
LPWRGND1 pwrgnd N017 {con1_len*20n} Rser={con1_len*.5m}
R25 dgnd N017 25m
V7 N039 sgnd PULSE(0 {voutput/18} 1u 1n 1n {1/(freq*2)} {1/freq})
V8 impulse N039 PULSE(0 {-voutput/18} {1u+(1/(freq*2))} 1n 1n {1/(freq*2)} {1/freq})
C11 N052 sinus 470µ V=6.3 Irms=290m Rser=0.5 Lser=3n Rpar=100k Cpar=3p
C14 vcc+ pwrgnd 1000µ V=63 Irms=2.77 Rser=0.036 Lser=5n Rpar=100k Cpar=3p mfg="Nichicon" pn="UPW1J102MHD6" type="Al electrolytic"
C17 pwrgnd vcc- 1000µ V=63 Irms=2.77 Rser=0.036 Lser=5n Rpar=100k Cpar=3p mfg="Nichicon" pn="UPW1J102MHD6" type="Al electrolytic"
C16 N003 N030 6800µ V=50 Irms=2.5 Rser=0.08 Lser=20n Rpar=40k Cpar=3p mfg="Nichicon" pn="UVZ1H682MRD" type="Al electrolytic"
C22 N023 N022 6800µ V=50 Irms=2.5 Rser=0.08 Lser=20n Rpar=40k Cpar=3p mfg="Nichicon" pn="UVZ1H682MRD" type="Al electrolytic"
C23 N003 N025 6800µ V=50 Irms=2.5 Rser=0.08 Lser=20n Rpar=40k Cpar=3p mfg="Nichicon" pn="UVZ1H682MRD" type="Al electrolytic"
L3 N023 N024 2n Rser=1m
L7 N029 0 2n Rser=1m
L8 N024 N025 2n Rser=1m
L9 0 N030 2n Rser=1m
L12 N024 0 2n Rser=1m
R37 N059 N069 200
R51 vcc+ N027 100k
R62 N041 vcc- 100k
D13 N027 sgnd MMSD4148
D14 sgnd N041 MMSD4148
R§POFFSET1 N027 N035 {1+(10k*OFFSET)}
R§POFFSET2 N035 N041 {1+(10k*(1-OFFSET))}
R65 N036 N035 1k
C26 sgnd N036 22µ V=50 Irms=90m Rser=2 Lser=2n Rpar=2meg Cpar=2p mfg="Panasonic" pn="ECEA1HN220U" type="Al bipolar"
R66 offset N036 22k
V4 AC1 preout 0
V6 out1 AC2 0
R68 N070 N069 22
R69 N044 N043 22
LGSPK1 gspk N011 {con1_len*20n} Rser={con1_len*.5m}
R78 N012 N011 25m
LSPKN1 gspk N009 {con2_len*20n} Rser={con2_len*.5m}
R79 SPK- N009 25m
V9 N040 sgnd SINE(0 {voutput/72} 19k)
V10 N033 N040 SINE(0 {voutput/72} 17k)
Q5 vcc+ vcc+ N057 0 BC846B
Q9 N073 N074 N076 0 BC846B
Q10 N064 N058 N057 0 BC856B
Q12 vcc- vcc- N076 0 BC856B
R10 N043 vas 11
C8 N043 N069 47µ V=6.3 Irms=290m Rser=0.5 Lser=3n Rpar=100k Cpar=3p mfg="Nichicon" pn="UPW0J221MED1TD" type="Al electrolytic"
R14 vcc+ N019 24
Q14 N078 N045 N061 0 CA_BC560C
R11 N080 vcc- 24
R44 N079 vcc- 560
Q15 N042 N034 N031 0 2SA1381F
R27 vcc+ N031 560
R40 N034 pgnd 22k
C9 vas N069 100n Rser=30m Lser=3n Rpar=700k
V12 N026 N033 SINE(0 {voutput/72} 3k)
V13 imd N026 SINE(0 {voutput/72} 5k)
Q1 N020 N045 N048 0 CA_BC550C
Q6 N050 N075 N079 0 2SC3503F
R3 pgnd N075 22k
C3 N004 sgnd 2200µ V=10 Irms=1.25 Rser=0.08 Lser=10n Rpar=110k Cpar=3p
R4 nfb N004 100
R7 out1 nfb 1k8
C12 vas N053 680p
R8 preout N053 750
Q8 vcc- nfb N062 0 CA_BC560C
Q11 vcc+ nfb N049 0 CA_BC550C
R5 vcc+ N020 470
R6 N078 vcc- 470
R9 N048 N050 51
R12 N049 N050 51
R13 N042 N061 51
R15 N042 N062 51
R16 out1 N008 1k8
C2 N008 nfb 10p
C13 N053 nfb 68p
Q13 N069 N075 N077 0 2SC3503F
Q3 N077 N078 N080 0 CA_BC550C
Q7 vas N034 N032 0 2SA1381F
Q4 N032 N020 N019 0 CA_BC560C
V14 N075 vcc- 2.54 Rser=10
V15 vcc+ N034 2.54 Rser=10
.model D D
.lib standard.dio
.model NPN NPN
.model PNP PNP
.lib standard.bjt
.op
.option plotwinsize=0
.option noopiter
* Transient
.four {freq} 10 10 v(SPK+,SPK-)
.param prb=0
.param timestep {1/((262144/8)*freq)}
.param freq 1k
.param stoptime {iterations/freq}
;ac oct 100 10 100meg
* .step param prb list -1 1
* AC analysis
.param iterations 100
.lib usr/ONNN_BJT.lib
.param Zimp 8
.param Zreal Zimp/2
.param Zimg (Zimp*sqrt(3))/(4*pi*freq)
.param supplyPWR 100
.param supplyVLT 24
.lib usr/STM_D.lib
.lib usr/FCS_BJT.lib
.param voutput 25
.param supplyK 0.06
.param rser {(supplyVLT*supplyVLT*supplyK)/(2*supplyPWR)}
;tran 0 {stoptime} 1n {timestep}
.param phi 90
.param con1_len 15
KCON1 LVCC LSGND LGSPK1 LGSPK2 LPGND LPWRGND1 LPWRGND2 LVEE LDGND 0.8
.param con2_len 15m
KCON2 LSPKP LOUTR LSPKN1 LSPKN2 0.8
KOTR LTRF LTRR 0.9
* Konektor zvucnika i zvucnik
* Konektor napajanja, star ground i napajanje
* Napajanje digitalnog dela, indikatori preopterecenja i klipinga
* Ulazni parametri kola
* Izlazni transformator
* AC sonda
* Masa digitalnog
* dela dolazi sa
* upravljacke ploce.
.lib usr/FCS_D.lib
.param BIAS 0.5
.param OFFSET 0.6
* Kolo za ponistavanje offset-a
.lib usr/ONNN_D.lib
.lib usr/TSE_BJT.lib
.backanno
.end